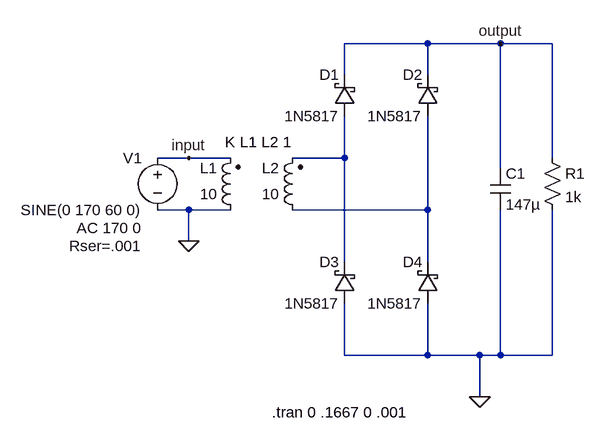
[diagram p0: schematic fullwave_schottky_smooth.asc]
fullwave_schottky_smooth.asc, the LTspice schematic file:
Version 4
SHEET 1 880 680
WIRE 320 -48 192 -48
WIRE 432 -48 320 -48
WIRE 512 -48 432 -48
WIRE 192 0 192 -48
WIRE 320 0 320 -48
WIRE -48 128 -96 128
WIRE 16 128 -48 128
WIRE 192 128 192 64
WIRE 192 128 112 128
WIRE 512 128 512 -48
WIRE 432 144 432 -48
WIRE -48 208 -96 208
WIRE 16 208 -48 208
WIRE 320 208 320 64
WIRE 320 208 112 208
WIRE -48 256 -48 208
WIRE 192 288 192 128
WIRE 320 288 320 208
WIRE 192 432 192 352
WIRE 320 432 320 352
WIRE 320 432 192 432
WIRE 400 432 320 432
WIRE 432 432 432 208
WIRE 432 432 400 432
WIRE 512 432 512 208
WIRE 512 432 432 432
WIRE 400 496 400 432
FLAG -48 256 0
FLAG 400 496 0
FLAG -48 128 input
FLAG 432 -48 output
SYMBOL voltage -96 112 M0
WINDOW 123 24 124 Left 2
WINDOW 39 24 152 Left 2
SYMATTR Value2 AC 170 0
SYMATTR SpiceLine Rser=.001
SYMATTR InstName V1
SYMATTR Value SINE(0 170 60 0)
SYMBOL schottky 208 64 R180
WINDOW 0 24 64 Left 2
WINDOW 3 24 0 Left 2
SYMATTR InstName D1
SYMATTR Value 1N5817
SYMATTR Description Diode
SYMATTR Type diode
SYMBOL res 496 112 R0
SYMATTR InstName R1
SYMATTR Value 1k
SYMBOL ind2 32 224 R180
WINDOW 0 36 80 Left 2
WINDOW 3 36 40 Left 2
SYMATTR InstName L1
SYMATTR Value 10
SYMATTR Type ind
SYMBOL ind2 128 224 R180
WINDOW 0 36 80 Left 2
WINDOW 3 36 40 Left 2
SYMATTR InstName L2
SYMATTR Value 10
SYMATTR Type ind
SYMBOL cap 416 144 R0
SYMATTR InstName C1
SYMATTR Value 147µ
SYMBOL schottky 336 64 R180
WINDOW 0 24 64 Left 2
WINDOW 3 24 0 Left 2
SYMATTR InstName D2
SYMATTR Value 1N5817
SYMATTR Description Diode
SYMATTR Type diode
SYMBOL schottky 208 352 R180
WINDOW 0 24 64 Left 2
WINDOW 3 24 0 Left 2
SYMATTR InstName D3
SYMATTR Value 1N5817
SYMATTR Description Diode
SYMATTR Type diode
SYMBOL schottky 336 352 R180
WINDOW 0 24 64 Left 2
WINDOW 3 24 0 Left 2
SYMATTR InstName D4
SYMATTR Value 1N5817
SYMATTR Description Diode
SYMATTR Type diode
TEXT 80 520 Left 2 !.tran 0 .1667 0 .001
TEXT 8 104 Left 2 !K L1 L2 1

The netlist it stands for:
* fullwave_schottky_smooth.asc
V1 input 0 SINE(0 170 60 0) AC 170 0 Rser=.001
D1 N001 output 1N5817
R1 output 0 1k
L1 0 input 10
L2 N002 N001 10
C1 output 0 147µ
D2 N002 output 1N5817
D3 0 N001 1N5817
D4 0 N002 1N5817
.model D D
.lib standard.dio
.tran 0 .1667 0 .001
K L1 L2 1
.backanno
.end